# EAGLE design PoElli-mech-tests (EAGLE 6.5.0)

## Sheet 1 of 6
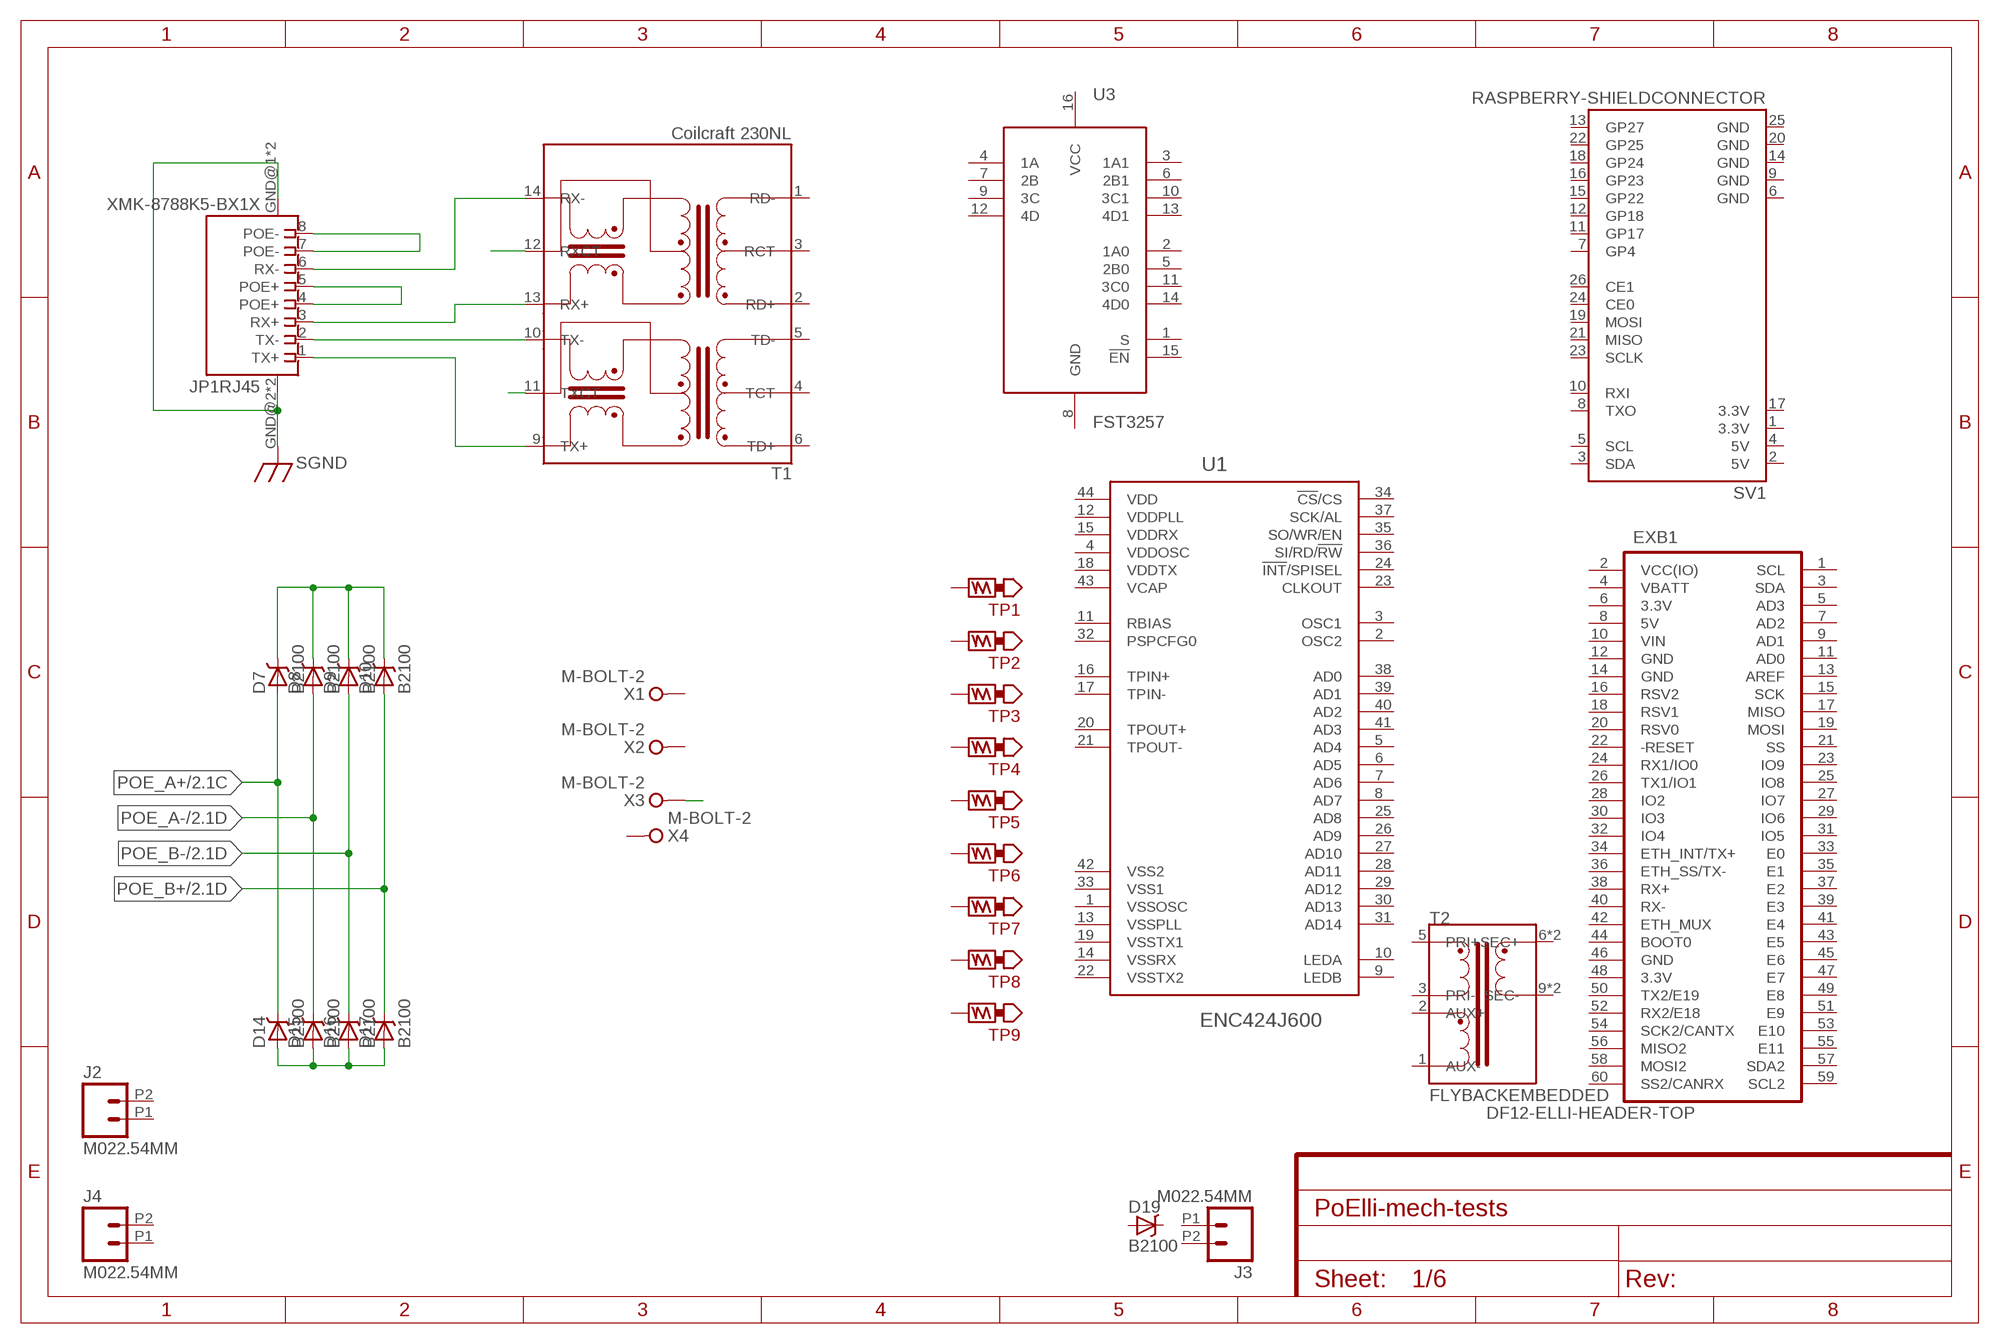
[diagram p0: schematic, sheet 1]

### Parts
D7  B2100  DIODE-SCHOTTKYB2100  [DIODE-B2100]
D8  B2100  DIODE-SCHOTTKYB2100  [DIODE-B2100]
D9  B2100  DIODE-SCHOTTKYB2100  [DIODE-B2100]
D10  B2100  DIODE-SCHOTTKYB2100  [DIODE-B2100]
D14  B2100  DIODE-SCHOTTKYB2100  [DIODE-B2100]
D15  B2100  DIODE-SCHOTTKYB2100  [DIODE-B2100]
D16  B2100  DIODE-SCHOTTKYB2100  [DIODE-B2100]
D17  B2100  DIODE-SCHOTTKYB2100  [DIODE-B2100]
D19  B2100  DIODE-SCHOTTKYB2100  [DIODE-B2100]
EXB1  DF12-ELLI-HEADER-TOP  [DF12(4.0)-60DP-0.5V]
J2  M022.54MM  M022.54MM_SCREWTERM  [1X02_2.54_SCREWTERM]
J3  M022.54MM  M022.54MM_SCREWTERM  [1X02_2.54_SCREWTERM]
J4  M022.54MM  M022.54MM_SCREWTERM  [1X02_2.54_SCREWTERM]
JP1  XMK-8788K5-BX1X  POE-TP-SHIELDED-LEDSTE1888250  [TE1888250]
SV1  RASPBERRY-SHIELDCONNECTOR  [RASPBERRYPI-SHIELD-CONNECTOR]
T1  Coilcraft 230NL  POE-ISOLATION-230NL  [COILCRAFT-ETH1-230L]
T2  FLYBACKEMBEDDED  [WE_EP13_SMD_10PIN_EMBEDDED]
TP1  TEST_POINT-5000  [TP_5021]
TP2  TEST_POINT-5021  [TP_5000]
TP3  TEST_POINT-5021  [TP_5000]
TP4  TEST_POINT-5021  [TP_5000]
TP5  TEST_POINT-5000  [TP_5021]
TP6  TEST_POINT-5000  [TP_5021]
TP7  TEST_POINT-5000  [TP_5021]
TP8  TEST_POINT-5000  [TP_5021]
TP9  TEST_POINT-5000  [TP_5021]
U1  ENC424J600  [TQFP44-0.8MM]
U3  FST3257  [SOIC-16-NARROW]
X1  M-BOLT-2  [M2-1]
X2  M-BOLT-2  [M2-1]
X3  M-BOLT-2  [M2-1]
X4  M-BOLT-2  [M2-1]

### Nets
N$1: JP1.2(RJ45:TX-) T1.10(TX-)
N$2: JP1.1(RJ45:TX+) T1.9(TX+)
N$3: JP1.3(RJ45:RX+) T1.13(RX+)
N$4: JP1.6(RJ45:RX-) T1.14(RX-)
N$6: D7.C D8.C D9.C D10.C
N$8: D14.A D15.A D16.A D17.A
N$10: JP1.7(RJ45:POE-) JP1.8(RJ45:POE-)
N$13: T1.11(TXCT)
N$21: X3.1(KL1)
POE_A+: D7.A D14.C ; also sheet 2
POE_A-: D8.A D15.C T1.12(RXCT) ; also sheet 2
POE_B+: D10.A D17.C JP1.4(RJ45:POE+) JP1.5(RJ45:POE+) ; also sheet 2
POE_B-: D9.A D16.C ; also sheet 2
RTN: JP1.GND@1(RJ45:GND) JP1.GND@2(RJ45:GND) JP1.GND@3(RJ45:GND) JP1.GND@4(RJ45:GND) ; supply symbol labelled SGND ; also sheet 2
Unconnected: D19.A D19.C EXB1.1(SCL) EXB1.3(SDA) EXB1.5(AD3) EXB1.7(AD2) EXB1.9(AD1) EXB1.11(AD0) EXB1.13(AREF) EXB1.15(SCK) EXB1.16(RSV2) EXB1.17(MISO) EXB1.18(RSV1) EXB1.19(MOSI) EXB1.20(RSV0) EXB1.21(SS) EXB1.22(-RESET) EXB1.23(IO9) EXB1.24(RX1/IO0) EXB1.25(IO8) EXB1.26(TX1/IO1) EXB1.27(IO7) EXB1.28(IO2) EXB1.29(IO6) EXB1.30(IO3) EXB1.31(IO5) EXB1.32(IO4) EXB1.33(E0) EXB1.34(ETH_INT/TX+) EXB1.35(E1) EXB1.36(ETH_SS/TX-) EXB1.37(E2) EXB1.38(RX+) EXB1.39(E3) EXB1.40(RX-) EXB1.41(E4) EXB1.42(ETH_MUX) EXB1.43(E5) EXB1.44(BOOT0) EXB1.45(E6) EXB1.46(GND) EXB1.47(E7) EXB1.48(3.3V) EXB1.49(E8) EXB1.50(TX2/E19) EXB1.51(E9) EXB1.52(RX2/E18) EXB1.53(E10) EXB1.54(SCK2/CANTX) EXB1.55(E11) EXB1.56(MISO2) EXB1.57(SDA2) EXB1.58(MOSI2) EXB1.59(SCL2) EXB1.60(SS2/CANRX) J2.P1 J2.P2 J3.P1 J3.P2 J4.P1 J4.P2 JP1.9(LED1:C) JP1.10(LED1:A) JP1.11(LED2:A) JP1.12(LED2:C) SV1.3(SDA) SV1.5(SCL) SV1.7(GP4) SV1.8(TXO) SV1.10(RXI) SV1.11(GP17) SV1.12(GP18) SV1.13(GP27) SV1.15(GP22) SV1.16(GP23) SV1.18(GP24) SV1.19(MOSI) SV1.21(MISO) SV1.22(GP25) SV1.23(SCLK) SV1.24(CE0) SV1.26(CE1) T1.1(RD-) T1.2(RD+) T1.3(RCT) T1.4(TCT) T1.5(TD-) T1.6(TD+) T2.1(AUX-) T2.2(AUX+) T2.3(PRI-) T2.5(PRI+) T2.6(SEC+) T2.7(SEC+) T2.9(SEC-) T2.10(SEC-) TP1.P$1 TP2.P$1 TP3.P$1 TP4.P$1 TP5.P$1 TP6.P$1 TP7.P$1 TP8.P$1 TP9.P$1 U1.2(OSC2) U1.3(OSC1) U1.5(AD4) U1.6(AD5) U1.7(AD6) U1.8(AD7) U1.9(LEDB) U1.10(LEDA) U1.11(RBIAS) U1.16(TPIN+) U1.17(TPIN-) U1.20(TPOUT+) U1.21(TPOUT-) U1.23(CLKOUT) U1.24(!INT!/SPISEL) U1.25(AD8) U1.26(AD9) U1.27(AD10) U1.28(AD11) U1.29(AD12) U1.30(AD13) U1.31(AD14) U1.32(PSPCFG0) U1.34(!CS!/CS) U1.35(SO/WR/EN) U1.36(SI/RD/!RW) U1.37(SCK/AL) U1.38(AD0) U1.39(AD1) U1.40(AD2) U1.41(AD3) U3.1(S) U3.2(1A0) U3.3(1A1) U3.4(1A) U3.5(2B0) U3.6(2B1) U3.7(2B) U3.9(3C) U3.10(3C1) U3.11(3C0) U3.12(4D) U3.13(4D1) U3.14(4D0) U3.15(!EN) X1.1(KL1) X2.1(KL1) X4.1(KL1)

## Sheet 2 of 6
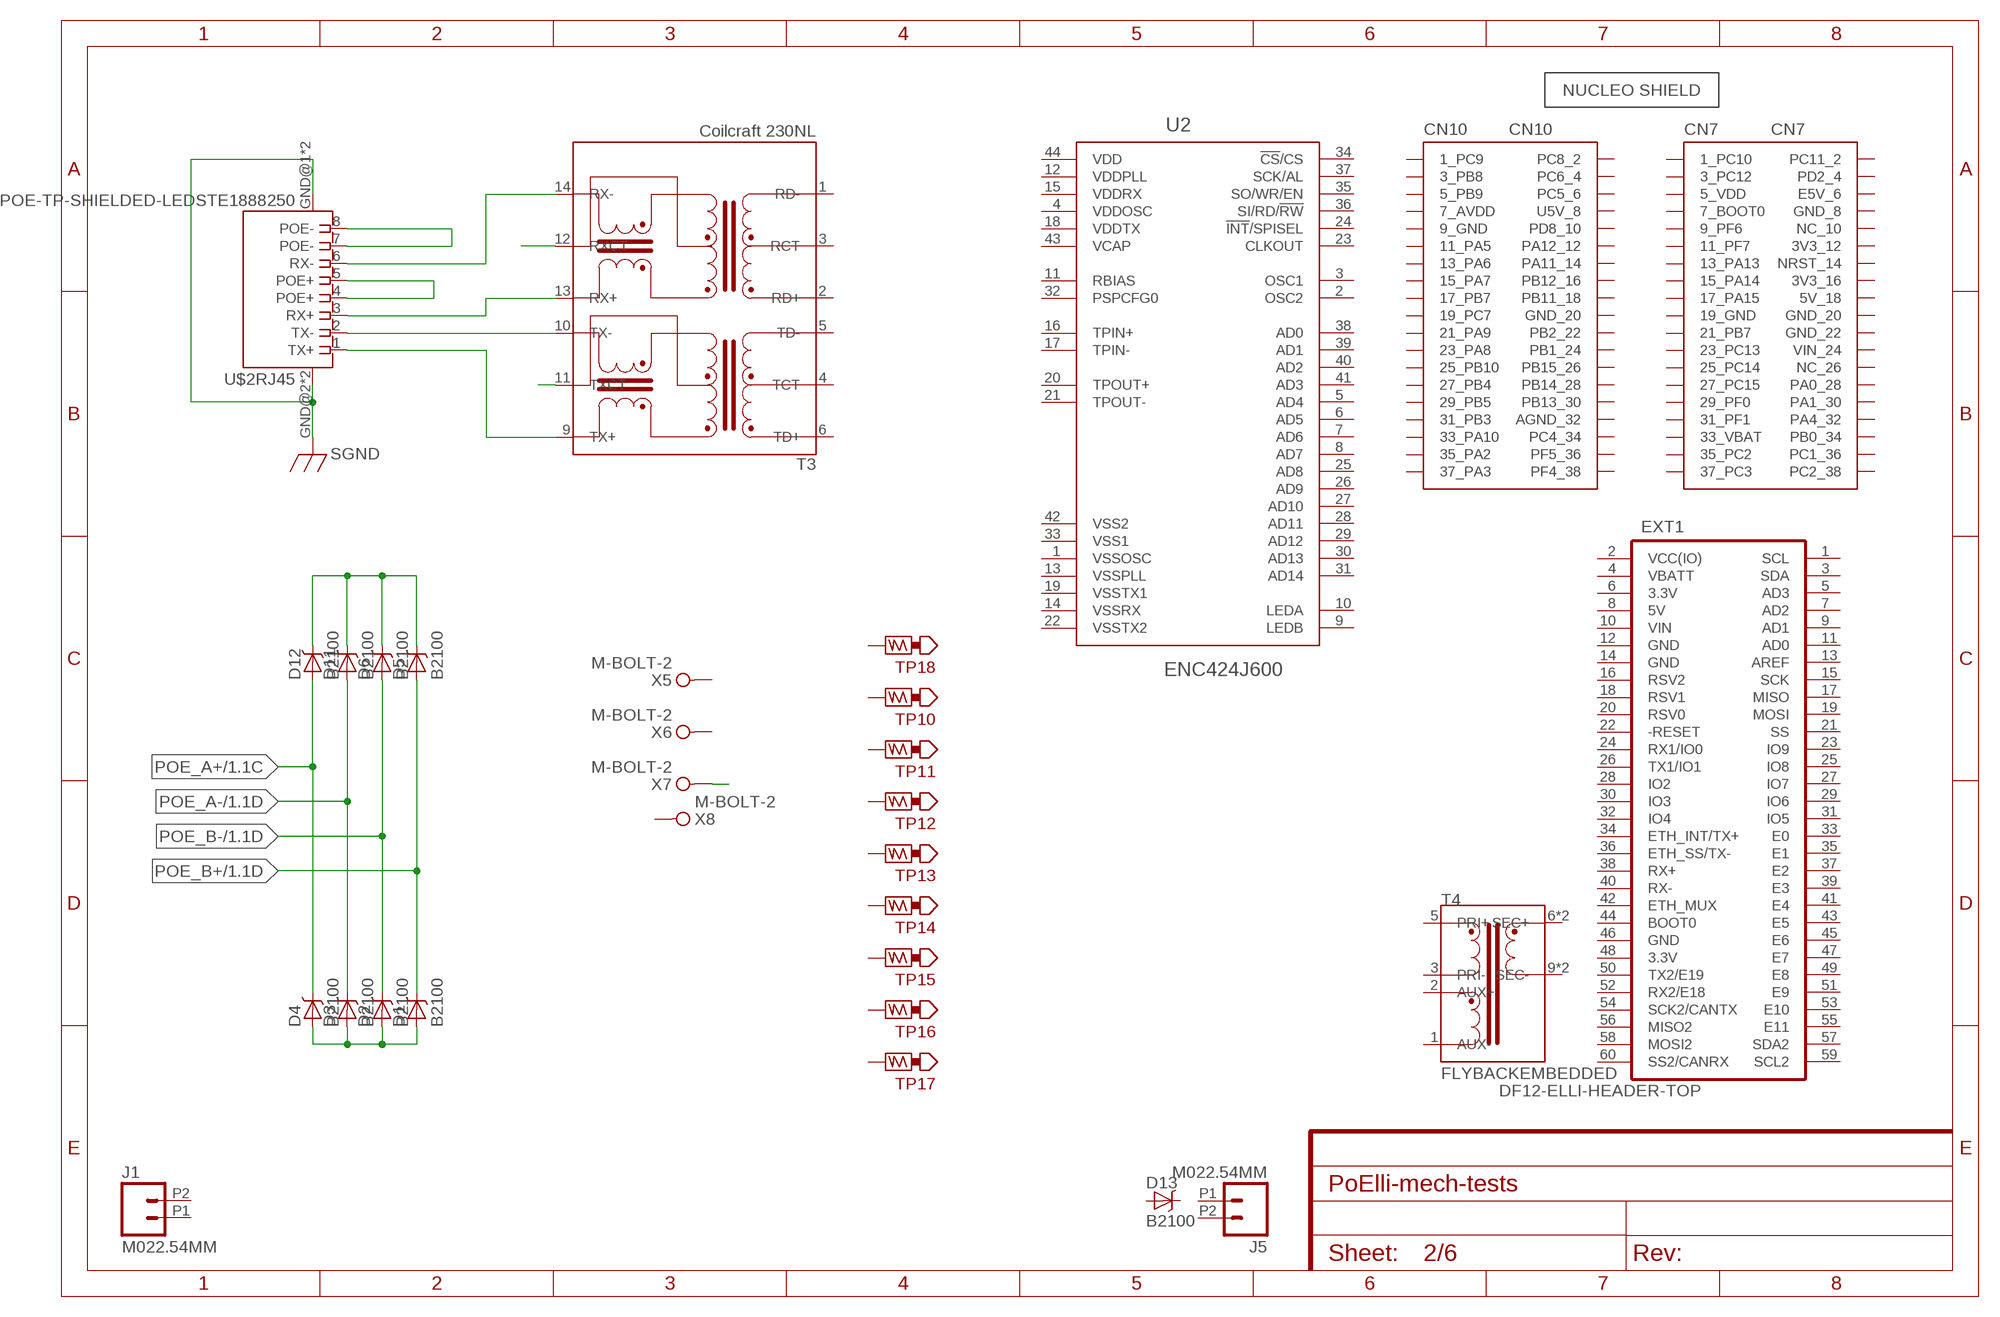
[diagram p1: schematic, sheet 2]

### Parts
CN7  NUCLEO-CN7  [NUCLEO-HEADER]
CN10  NUCLEO-CN10  [NUCLEO-HEADER]
D1  B2100  DIODE-SCHOTTKYB2100  [DIODE-B2100]
D2  B2100  DIODE-SCHOTTKYB2100  [DIODE-B2100]
D3  B2100  DIODE-SCHOTTKYB2100  [DIODE-B2100]
D4  B2100  DIODE-SCHOTTKYB2100  [DIODE-B2100]
D5  B2100  DIODE-SCHOTTKYB2100  [DIODE-B2100]
D6  B2100  DIODE-SCHOTTKYB2100  [DIODE-B2100]
D11  B2100  DIODE-SCHOTTKYB2100  [DIODE-B2100]
D12  B2100  DIODE-SCHOTTKYB2100  [DIODE-B2100]
D13  B2100  DIODE-SCHOTTKYB2100  [DIODE-B2100]
EXT1  DF12-ELLI-HEADER-TOP  [DF12(4.0)-60DP-0.5V]
J1  M022.54MM  M022.54MM_SCREWTERM  [1X02_2.54_SCREWTERM]
J5  M022.54MM  M022.54MM_SCREWTERM  [1X02_2.54_SCREWTERM]
NUCLEO  NUCLEO-OUTLINE-SHORT  [NUCLEO-SHIELD-UNDERSIDE-SHORT-OUTLINE]
T3  Coilcraft 230NL  POE-ISOLATION-230NL  [COILCRAFT-ETH1-230L]
T4  FLYBACKEMBEDDED  [WE_EP13_SMD_10PIN_EMBEDDED]
TP10  TEST_POINT-5021  [TP_5000]
TP11  TEST_POINT-5021  [TP_5000]
TP12  TEST_POINT-5021  [TP_5000]
TP13  TEST_POINT-5000  [TP_5021]
TP14  TEST_POINT-5000  [TP_5021]
TP15  TEST_POINT-5000  [TP_5021]
TP16  TEST_POINT-5000  [TP_5021]
TP17  TEST_POINT-5000  [TP_5021]
TP18  TEST_POINT-5000  [TP_5021]
U2  ENC424J600  [TQFP44-0.8MM]
U$2  POE-TP-SHIELDED-LEDSTE1888250  [TE1888250]
X5  M-BOLT-2  [M2-1]
X6  M-BOLT-2  [M2-1]
X7  M-BOLT-2  [M2-1]
X8  M-BOLT-2  [M2-1]

### Nets
N$5: T3.10(TX-) U$2.2(RJ45:TX-)
N$7: T3.9(TX+) U$2.1(RJ45:TX+)
N$9: T3.13(RX+) U$2.3(RJ45:RX+)
N$11: T3.14(RX-) U$2.6(RJ45:RX-)
N$12: D5.C D6.C D11.C D12.C
N$14: D1.A D2.A D3.A D4.A
N$15: X7.1(KL1)
N$16: U$2.7(RJ45:POE-) U$2.8(RJ45:POE-)
N$17: T3.11(TXCT)
POE_A+: D4.C D12.A ; also sheet 1
POE_A-: D3.C D11.A T3.12(RXCT) ; also sheet 1
POE_B+: D1.C D5.A U$2.4(RJ45:POE+) U$2.5(RJ45:POE+) ; also sheet 1
POE_B-: D2.C D6.A ; also sheet 1
RTN: U$2.GND@1(RJ45:GND) U$2.GND@2(RJ45:GND) U$2.GND@3(RJ45:GND) U$2.GND@4(RJ45:GND) ; supply symbol labelled SGND ; also sheet 1
Unconnected: CN7.1(1_PC10) CN7.2(PC11_2) CN7.3(3_PC12) CN7.4(PD2_4) CN7.5(5_VDD) CN7.6(E5V_6) CN7.7(7_BOOT0) CN7.8(GND_8) CN7.9(9_PF6) CN7.10(NC_10) CN7.11(11_PF7) CN7.12(3V3_12) CN7.13(13_PA13) CN7.14(NRST_14) CN7.15(15_PA14) CN7.16(3V3_16) CN7.17(17_PA15) CN7.18(5V_18) CN7.19(19_GND) CN7.20(GND_20) CN7.21(21_PB7) CN7.22(GND_22) CN7.23(23_PC13) CN7.24(VIN_24) CN7.25(25_PC14) CN7.26(NC_26) CN7.27(27_PC15) CN7.28(PA0_28) CN7.29(29_PF0) CN7.30(PA1_30) CN7.31(31_PF1) CN7.32(PA4_32) CN7.33(33_VBAT) CN7.34(PB0_34) CN7.35(35_PC2) CN7.36(PC1_36) CN7.37(37_PC3) CN7.38(PC2_38) CN10.1(1_PC9) CN10.2(PC8_2) CN10.3(3_PB8) CN10.4(PC6_4) CN10.5(5_PB9) CN10.6(PC5_6) CN10.7(7_AVDD) CN10.8(U5V_8) CN10.9(9_GND) CN10.10(PD8_10) CN10.11(11_PA5) CN10.12(PA12_12) CN10.13(13_PA6) CN10.14(PA11_14) CN10.15(15_PA7) CN10.16(PB12_16) CN10.17(17_PB7) CN10.18(PB11_18) CN10.19(19_PC7) CN10.20(GND_20) CN10.21(21_PA9) CN10.22(PB2_22) CN10.23(23_PA8) CN10.24(PB1_24) CN10.25(25_PB10) CN10.26(PB15_26) CN10.27(27_PB4) CN10.28(PB14_28) CN10.29(29_PB5) CN10.30(PB13_30) CN10.31(31_PB3) CN10.32(AGND_32) CN10.33(33_PA10) CN10.34(PC4_34) CN10.35(35_PA2) CN10.36(PF5_36) CN10.37(37_PA3) CN10.38(PF4_38) D13.A D13.C EXT1.1(SCL) EXT1.3(SDA) EXT1.5(AD3) EXT1.7(AD2) EXT1.9(AD1) EXT1.11(AD0) EXT1.13(AREF) EXT1.15(SCK) EXT1.16(RSV2) EXT1.17(MISO) EXT1.18(RSV1) EXT1.19(MOSI) EXT1.20(RSV0) EXT1.21(SS) EXT1.22(-RESET) EXT1.23(IO9) EXT1.24(RX1/IO0) EXT1.25(IO8) EXT1.26(TX1/IO1) EXT1.27(IO7) EXT1.28(IO2) EXT1.29(IO6) EXT1.30(IO3) EXT1.31(IO5) EXT1.32(IO4) EXT1.33(E0) EXT1.34(ETH_INT/TX+) EXT1.35(E1) EXT1.36(ETH_SS/TX-) EXT1.37(E2) EXT1.38(RX+) EXT1.39(E3) EXT1.40(RX-) EXT1.41(E4) EXT1.42(ETH_MUX) EXT1.43(E5) EXT1.44(BOOT0) EXT1.45(E6) EXT1.46(GND) EXT1.47(E7) EXT1.48(3.3V) EXT1.49(E8) EXT1.50(TX2/E19) EXT1.51(E9) EXT1.52(RX2/E18) EXT1.53(E10) EXT1.54(SCK2/CANTX) EXT1.55(E11) EXT1.56(MISO2) EXT1.57(SDA2) EXT1.58(MOSI2) EXT1.59(SCL2) EXT1.60(SS2/CANRX) J1.P1 J1.P2 J5.P1 J5.P2 T3.1(RD-) T3.2(RD+) T3.3(RCT) T3.4(TCT) T3.5(TD-) T3.6(TD+) T4.1(AUX-) T4.2(AUX+) T4.3(PRI-) T4.5(PRI+) T4.6(SEC+) T4.7(SEC+) T4.9(SEC-) T4.10(SEC-) TP10.P$1 TP11.P$1 TP12.P$1 TP13.P$1 TP14.P$1 TP15.P$1 TP16.P$1 TP17.P$1 TP18.P$1 U2.2(OSC2) U2.3(OSC1) U2.5(AD4) U2.6(AD5) U2.7(AD6) U2.8(AD7) U2.9(LEDB) U2.10(LEDA) U2.11(RBIAS) U2.16(TPIN+) U2.17(TPIN-) U2.20(TPOUT+) U2.21(TPOUT-) U2.23(CLKOUT) U2.24(!INT!/SPISEL) U2.25(AD8) U2.26(AD9) U2.27(AD10) U2.28(AD11) U2.29(AD12) U2.30(AD13) U2.31(AD14) U2.32(PSPCFG0) U2.34(!CS!/CS) U2.35(SO/WR/EN) U2.36(SI/RD/!RW) U2.37(SCK/AL) U2.38(AD0) U2.39(AD1) U2.40(AD2) U2.41(AD3) U$2.9(LED1:C) U$2.10(LED1:A) U$2.11(LED2:A) U$2.12(LED2:C) X5.1(KL1) X6.1(KL1) X8.1(KL1)

## Sheet 3 of 6
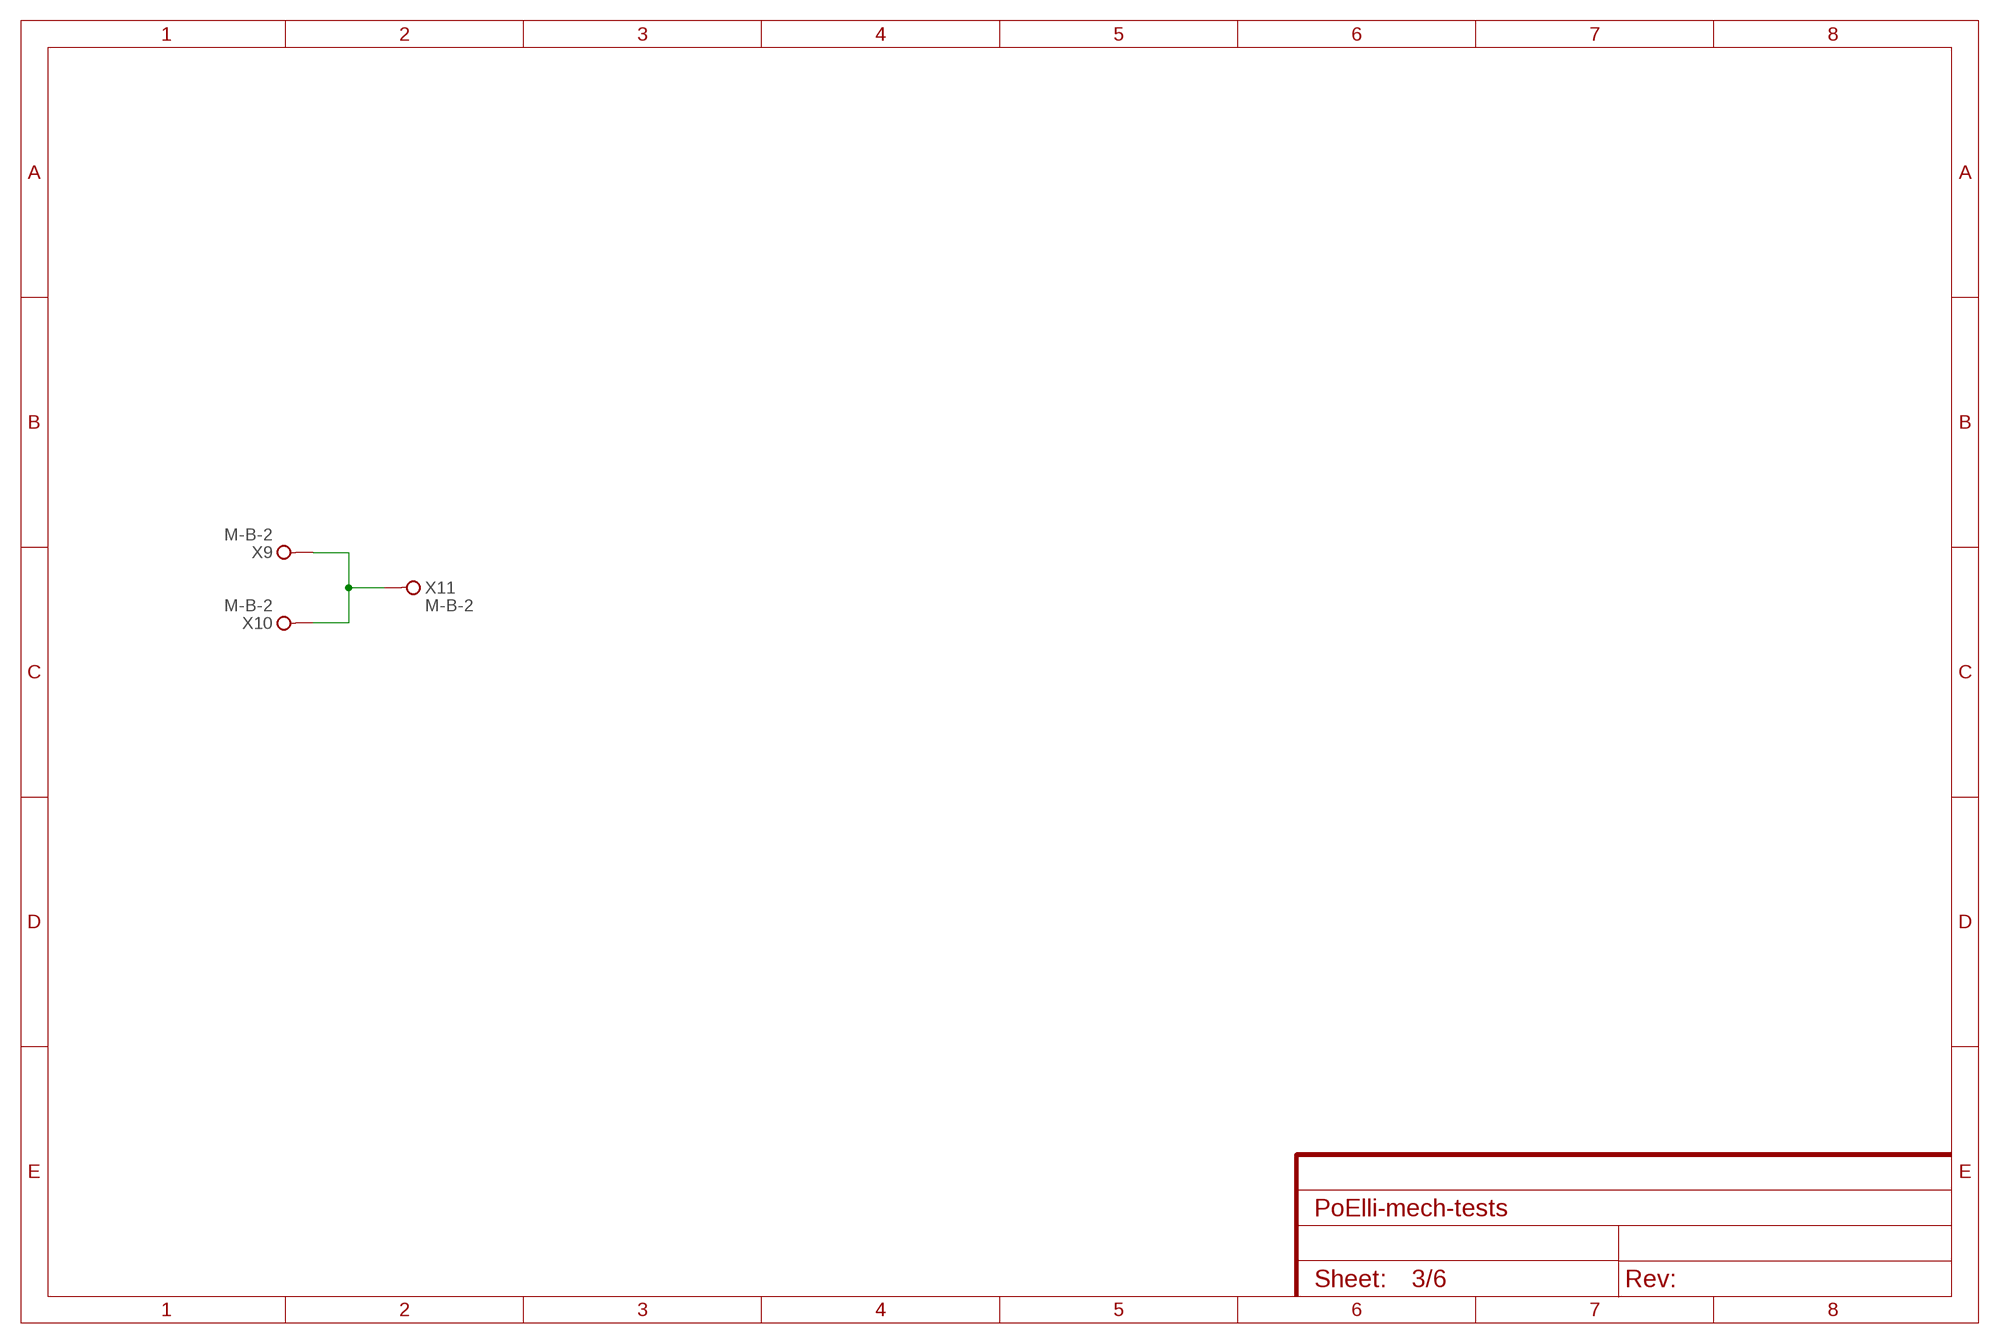
[diagram p2: schematic, sheet 3]

### Parts
X9  M-B-2  M-BOLT-2  [M2-1]
X10  M-B-2  M-BOLT-2  [M2-1]
X11  M-B-2  M-BOLT-2  [M2-1]

### Nets
PTEST [power]: X9.1(KL1) X10.1(KL1) X11.1(KL1)

## Sheet 4 of 6
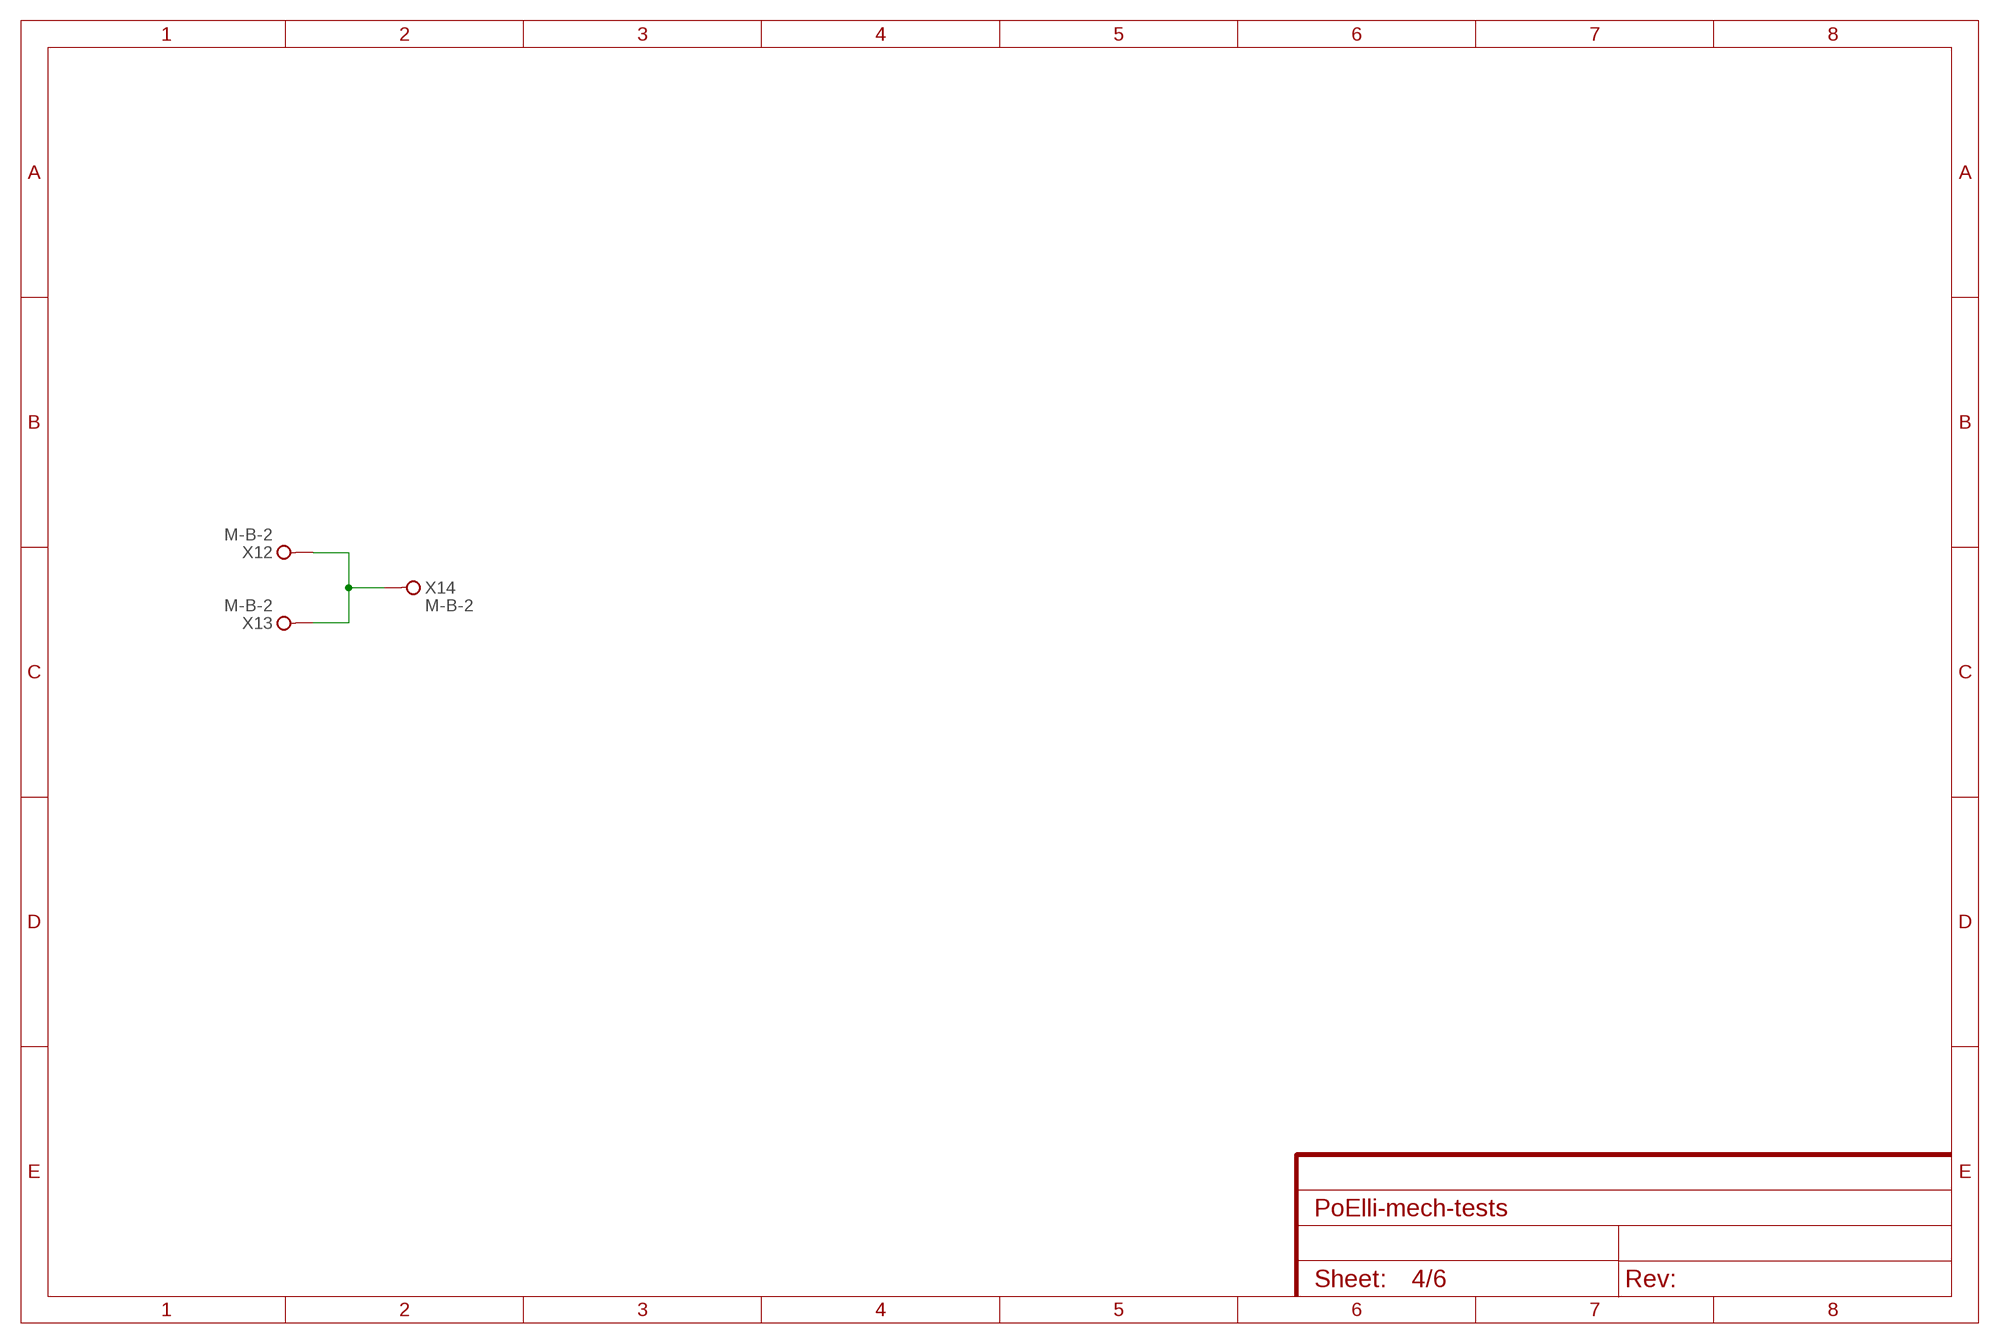
[diagram p3: schematic, sheet 4]

### Parts
X12  M-B-2  M-BOLT-2  [M2-1]
X13  M-B-2  M-BOLT-2  [M2-1]
X14  M-B-2  M-BOLT-2  [M2-1]

### Nets
PTEST1 [power]: X12.1(KL1) X13.1(KL1) X14.1(KL1)

## Sheet 5 of 6
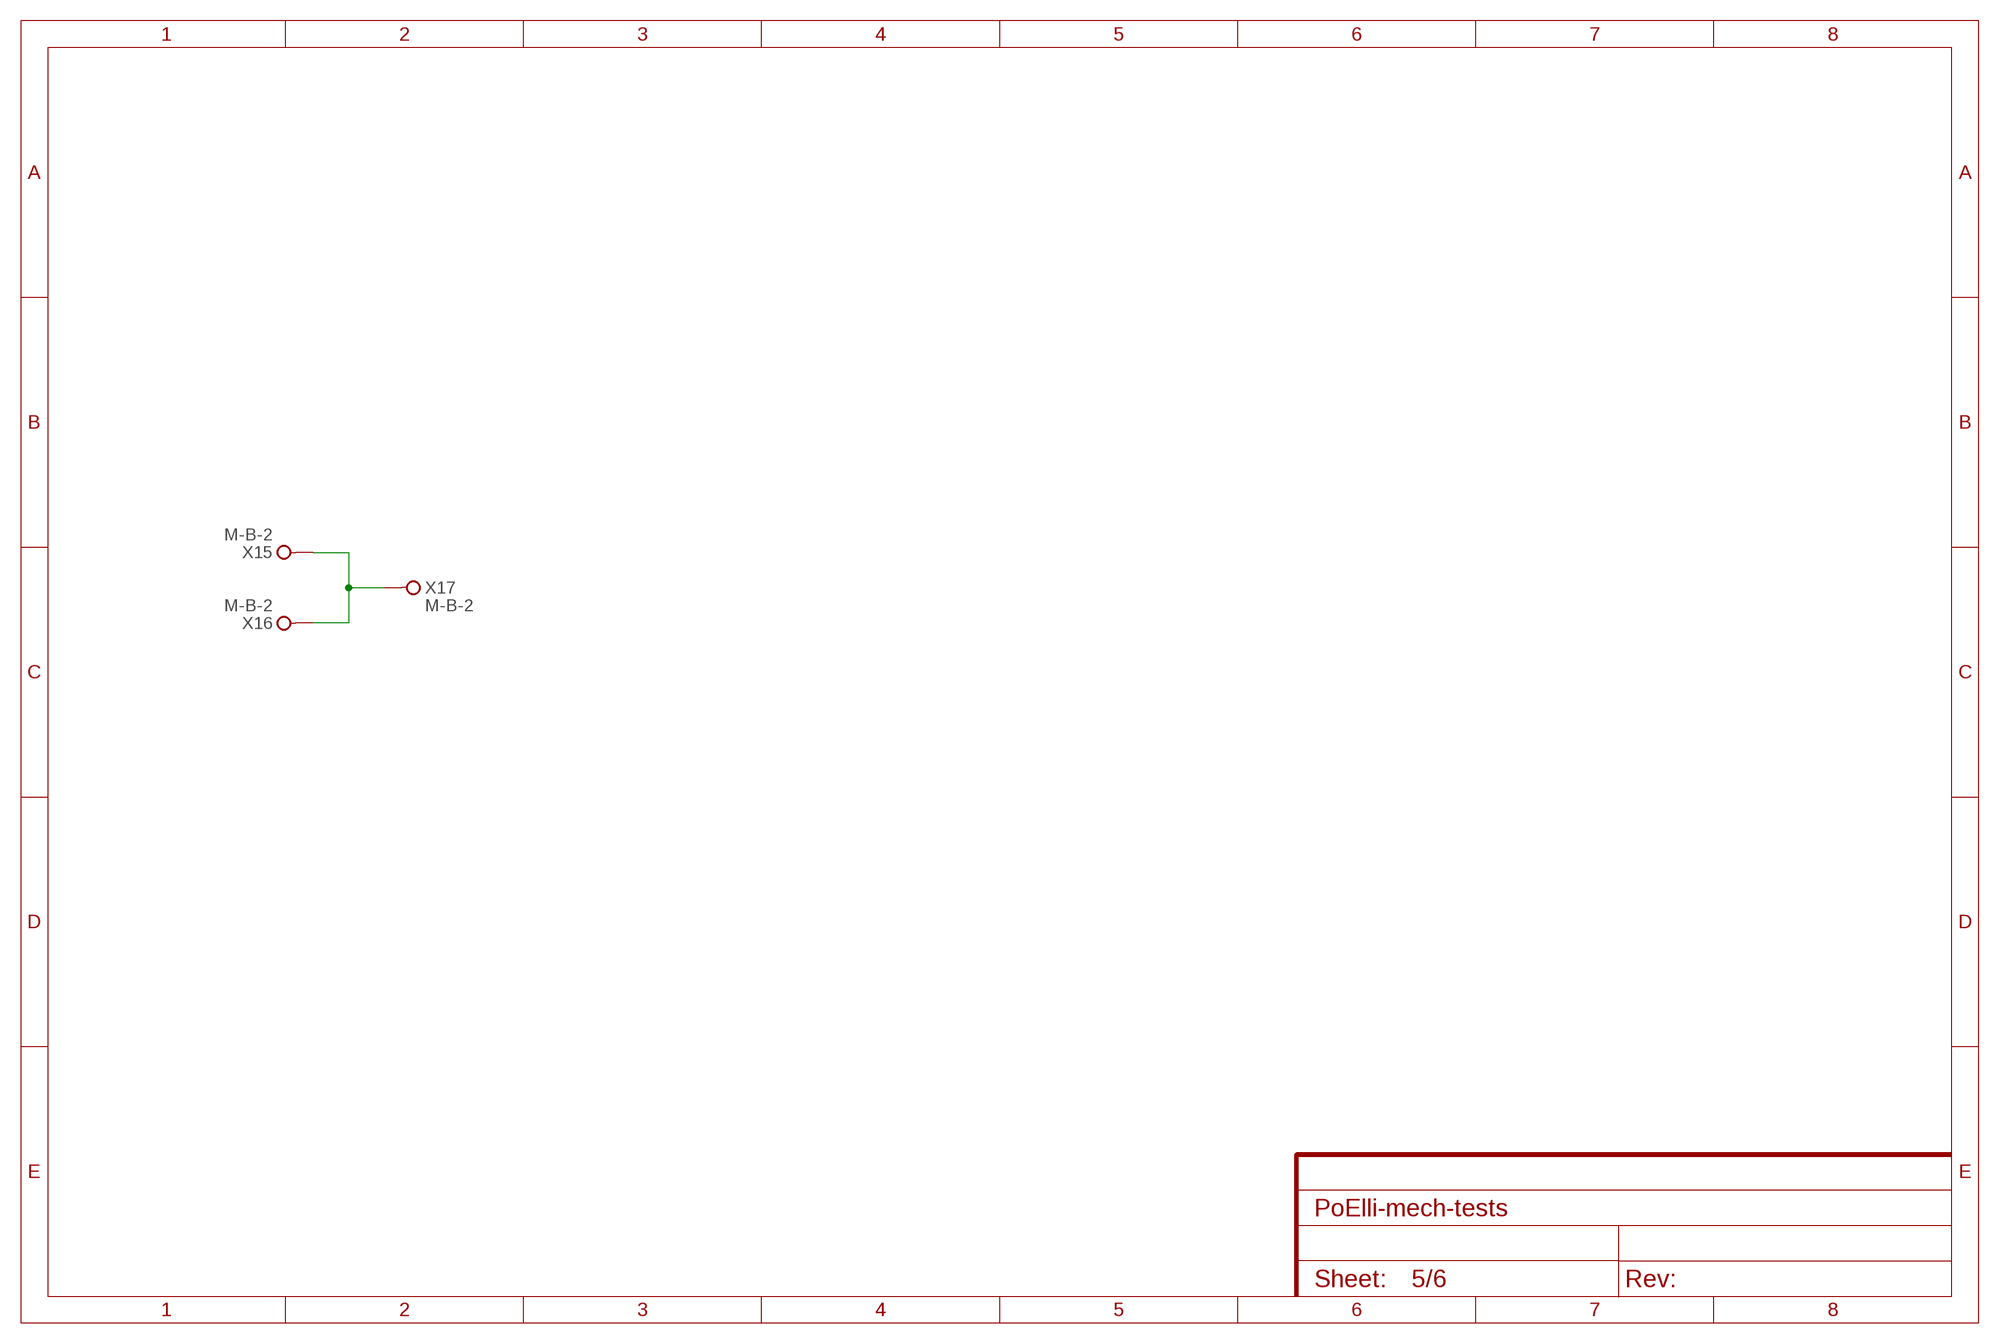
[diagram p4: schematic, sheet 5]

### Parts
X15  M-B-2  M-BOLT-2  [M2-1]
X16  M-B-2  M-BOLT-2  [M2-1]
X17  M-B-2  M-BOLT-2  [M2-1]

### Nets
PTEST2 [power]: X15.1(KL1) X16.1(KL1) X17.1(KL1)

## Sheet 6 of 6
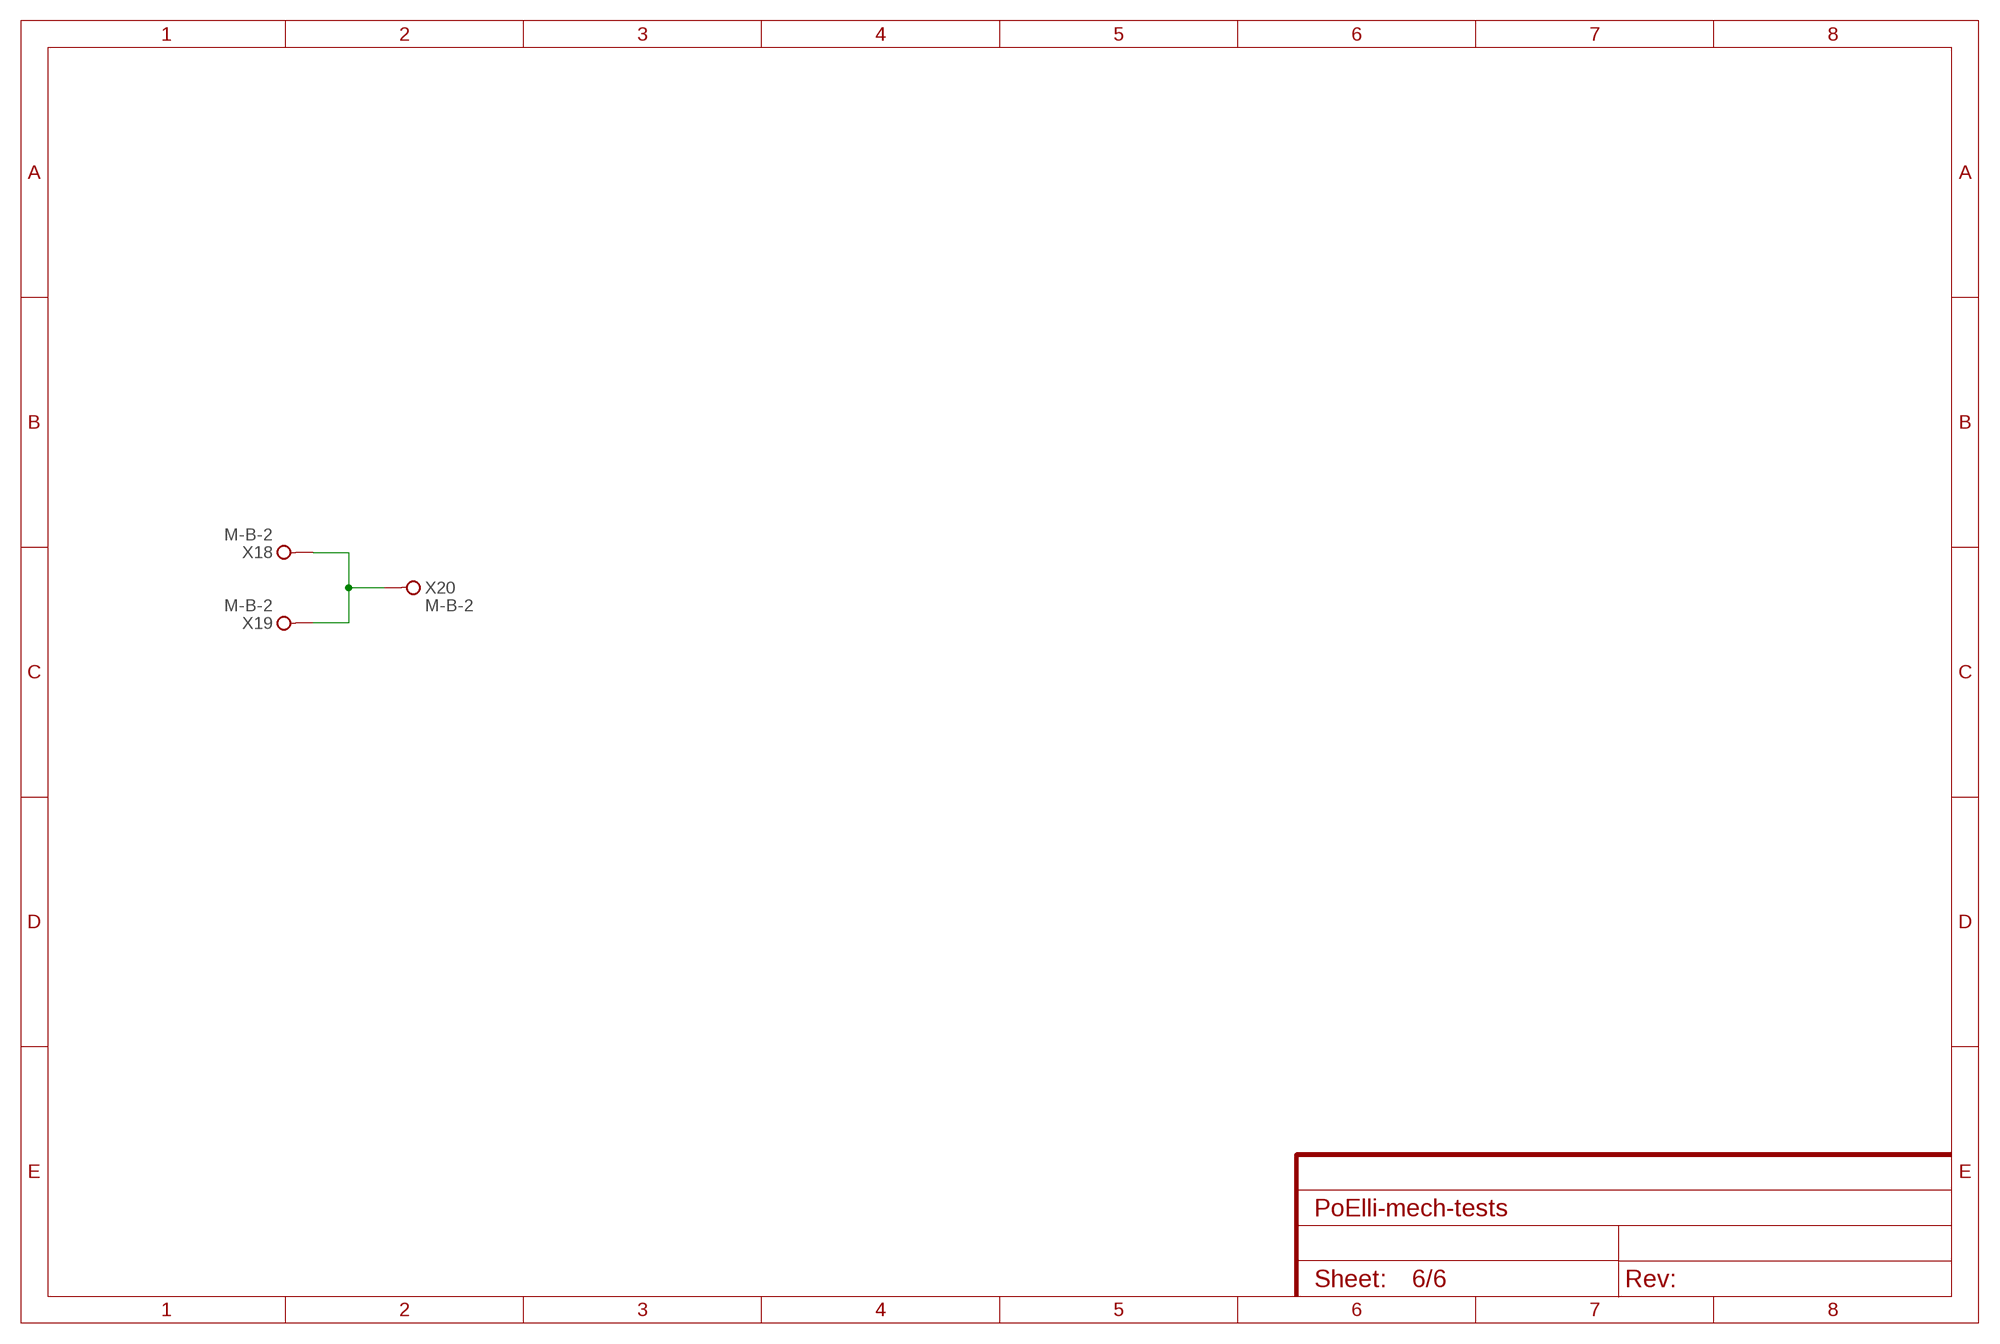
[diagram p5: schematic, sheet 6]

### Parts
X18  M-B-2  M-BOLT-2  [M2-1]
X19  M-B-2  M-BOLT-2  [M2-1]
X20  M-B-2  M-BOLT-2  [M2-1]

### Nets
PTEST3 [power]: X18.1(KL1) X19.1(KL1) X20.1(KL1)

## Power pins joined to a net without a drawn wire
3.3V: EXB1.6(3.3V) SV1.1(3.3V) SV1.17(3.3V)
3.3V1: EXT1.6(3.3V)
5V: EXB1.8(5V) SV1.2(5V) SV1.4(5V)
5V1: EXT1.8(5V)
GND: EXB1.12(GND) EXB1.14(GND) SV1.6(GND) SV1.9(GND) SV1.14(GND) SV1.20(GND) SV1.25(GND) U3.8(GND)
GND1: EXT1.12(GND) EXT1.14(GND)
VBATT: EXB1.4(VBATT)
VBATT1: EXT1.4(VBATT)
VCAP: U1.43(VCAP)
VCAP1: U2.43(VCAP)
VCC: U3.16(VCC)
VCC(IO): EXB1.2(VCC(IO))
VCC(IO)1: EXT1.2(VCC(IO))
VDD: U1.44(VDD)
VDD1: U2.44(VDD)
VDDOSC: U1.4(VDDOSC)
VDDOSC1: U2.4(VDDOSC)
VDDPLL: U1.12(VDDPLL)
VDDPLL1: U2.12(VDDPLL)
VDDRX: U1.15(VDDRX)
VDDRX1: U2.15(VDDRX)
VDDTX: U1.18(VDDTX)
VDDTX1: U2.18(VDDTX)
VIN: EXB1.10(VIN)
VIN1: EXT1.10(VIN)
VSS1: U1.33(VSS1)
VSS2: U1.42(VSS2)
VSS3: U2.42(VSS2)
VSS4: U2.33(VSS1)
VSSOSC: U1.1(VSSOSC)
VSSOSC1: U2.1(VSSOSC)
VSSPLL: U1.13(VSSPLL)
VSSPLL1: U2.13(VSSPLL)
VSSRX: U1.14(VSSRX)
VSSRX1: U2.14(VSSRX)
VSSTX1: U1.19(VSSTX1)
VSSTX2: U1.22(VSSTX2)
VSSTX3: U2.19(VSSTX1)
VSSTX4: U2.22(VSSTX2)

## Library data of the parts
CN7 = ELL-i-Boards:NUCLEO-CN7
CN10 = ELL-i-Boards:NUCLEO-CN10
D1-D17 D19 = ELL-i-DIscreteSemi:DIODE-SCHOTTKY: Schottky Diodes A Schottky diode has a low forward voltage drop and a very fast switching action. A normal silicon diode has a voltage drop between 0.6–0.7 volts, while a Schottky diode voltage drop is between approximately 0.15–0.45 volts. This lower voltage drop can provide higher switching speed and better system efficiency. Wikipedia article on Schottky diodes <https://en.wikipedia.org/wiki/Schottky_diode>
EXB1 EXT1 = ELL-i-Connectors:DF12-ELLI-*
J1-J5 = SparkFun-Connectors:M02: Standard 2-pin 0.1" header. Use with - straight break away headers ( PRT-00116) - right angle break away headers (PRT-00553) - swiss pins (PRT-00743) - machine pins (PRT-00117) - female headers (PRT-00115) Molex polarized connector foot print use with: PRT-08233 with associated crimp pins and housings. 2.54_SCREWTERM for use with PRT-10571. 3.5mm Screw Terminal footprints for PRT-08084 5mm Screw Terminal footprints for use with PRT-08433
JP1 U$2 = ELL-i-Connectors:POE-TP-SHIELDED-LEDS
NUCLEO = ELL-i-Boards:NUCLEO-OUTLINE
SV1 = ELL-i-Boards:RASPBERRY-SHIELD
T1 T3 = ELL-i-Transformers:POE-ISOLATION: Power-over-Ethernet isolation transformers In twisted pair Ethernet networks, there is a 1500V isolation transformer between the network cable and the connected device. In Power-over-Ethernet devices, the transformer provides the extra function of allowing the DC power to be extracted from the cable-side center taps of the transformer. For high-power PoE, the transformer cable-side winding must be of thick enough wire (i.e. have low-enough resistance) to carry the DC current without warming up too much. Isolation transformers <https://en.wikipedia.org/wiki/Isolation_transformer> (general article) Power-over-Ethernet <https://en.wikipedia.org/wiki/Power_over_Ethernet> (general article)
T2 T4 = ELL-i-Transformers:FLYBACK: Flyback SMPS transformer These types of transformers are often used in flyback and forward SMPS converters. The primary-side auxillary winding typically used to generate a 7-12 V auxillary voltage, which is used to generate the operating voltage (VCC) for the SMPS controller chip. The packages includes the ones used at various ELL-i boards.
TP1-TP18 = ELL-i-Passives:TEST_POINT: Used for easier attachment of measuring equipment. Has both test loops and bare copper area.
U1 U2 = ELL-i-DigitalIC:ENC424J600: ENC424J600 The ENC424J600 and ENC624J600 are stand-alone, Fast Ethernet controllers with an industry standard Serial Peripheral Interface (SPI) or a flexible parallel interface. They are designed to serve as an Ethernet network interface for any microcontroller equipped with SPI or a standard parallel port Not reviewed. Datasheet <http://ww1.microchip.com/downloads/en/DeviceDoc/39935b.pdf>
U3 = ELL-i-DigitalIC:FST3257: Quad 2:1 Multiplexer / Demultiplexer Bus Switch
X1-X20 = ELL-i-Connectors:M-BOLT: Metric bolt connector

## Net classes
1 power: width 0.813 mm, drill 0.813 mm, clearance 0.152 mm

## Board
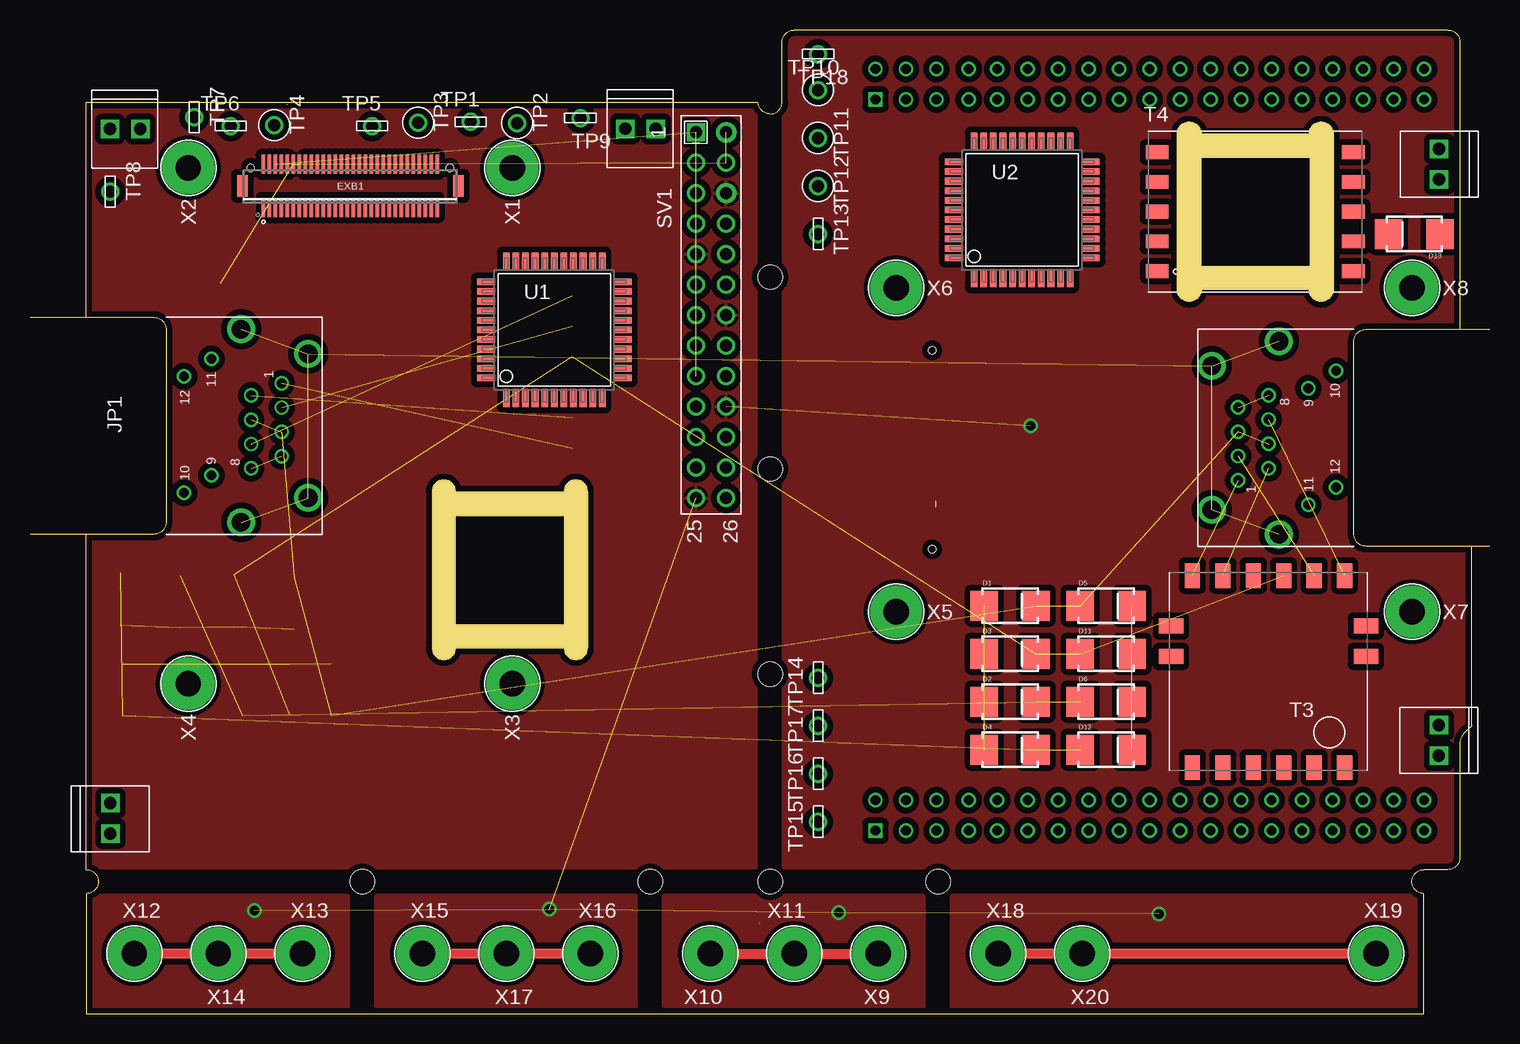
[diagram p6: board, top side]
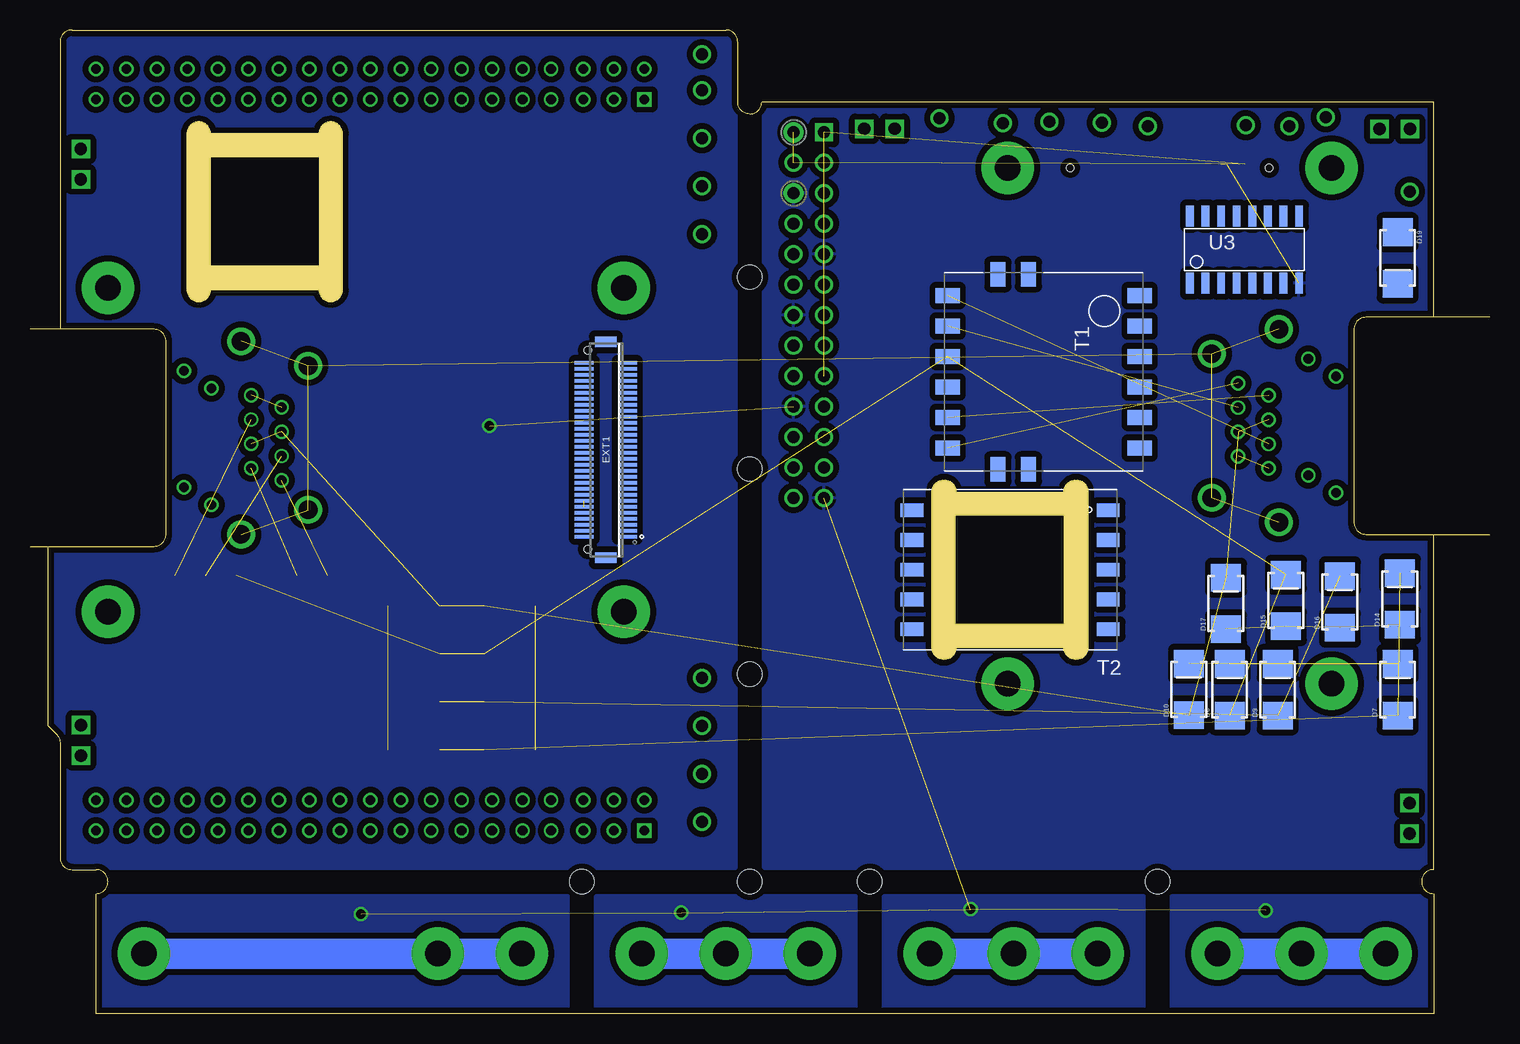
[diagram p7: board, bottom side, seen from below]

Size 121.7 x 82 mm. Coordinates in mm from the lower left corner, seen from the top.
Outline: 4.7,39.95 4.7,12 arc-90 5.7,11 arc-90 4.7,10 4.7,0 116.2,0 116.2,10 arc-90 115.2,11 arc-90 116.2,12 118.2,12 arc90 119.2,13 119.2,22.59 arc-45 119.49,23.29 120.2,24 120.2,38.95
Outline: 4.7,58.05 4.7,76 60.7,76 arc90 61.7,75 arc90 62.7,76 62.7,81 arc-90 63.7,82 118.2,82 arc-90 119.2,81 119.2,57.05
Outline: 52.7,0 74.7,0
Outline: 28.7,0 50.7,0
Copper layers (1*16): Top 0.035mm / dielectric 1.5mm / Bottom 0.035mm
Design rules "default *": minimum track width 0.15mm, minimum drill 0.4mm, track to track 0.5mm, track to pad 0.5mm, pad to pad 0.5mm, via to via 0.5mm, smd to smd 0mil, copper to edge 0.5mm, drill to drill 8mil, minimum pad ring 0.2mm, minimum via ring 0.2mm, stop-mask expansion 4mil, vias tented up to drill 0mil, thermal gap 10mil
Holes 2 mm at 27.7,11 51.7,11 61.7,11 75.7,11 61.7,28.3 61.7,45.4 61.7,61.4
tRestrict: 8 lines
bRestrict: 8 lines

### Footprints (pad centres in the part's own frame; a part is rotated, then mirrored left to right if it is on the bottom)
NUCLEO-HEADER = drill 0.8 square: 1 0,0 | drill 0.8: 2 0,2.54; 3 2.54,0; 4 2.54,2.54; 5 5.08,0; 6 5.08,2.54; 7 7.78,0; 8 7.78,2.54; 9 10.16,0; 10 10.16,2.54; 11 12.7,0; 12 12.7,2.54; 13 15.24,0; 14 15.24,2.54; 15 17.78,0; 16 17.78,2.54; 17 20.32,0; 18 20.32,2.54; 19 22.86,0; 20 22.86,2.54; 21 25.4,0; 22 25.4,2.54; 23 27.94,0; 24 27.94,2.54; 25 30.48,0; 26 30.48,2.54; 27 33.02,0; 28 33.02,2.54; 29 35.56,0; 30 35.56,2.54; 31 38.1,0; 32 38.1,2.54; 33 40.64,0; 34 40.64,2.54; 35 43.18,0; 36 43.18,2.54; 37 45.72,0; 38 45.72,2.54
DIODE-B2100 = smd 2.3 x 2.5: A -2.15,0; C 2.15,0
DF12(4.0)-60DP-0.5V = smd 0.3 x 1.6: 1 -7.25,-1.8; 2 -7.25,1.8; 3 -6.75,-1.8; 4 -6.75,1.8; 5 -6.25,-1.8; 6 -6.25,1.8; 7 -5.75,-1.8; 8 -5.75,1.8; 9 -5.25,-1.8; 10 -5.25,1.8; 11 -4.75,-1.8; 12 -4.75,1.8; 13 -4.25,-1.8; 14 -4.25,1.8; 15 -3.75,-1.8; 16 -3.75,1.8; 17 -3.25,-1.8; 18 -3.25,1.8; 19 -2.75,-1.8; 20 -2.75,1.8; 21 -2.25,-1.8; 22 -2.25,1.8; 23 -1.75,-1.8; 24 -1.75,1.8; 25 -1.25,-1.8; 26 -1.25,1.8; 27 -0.75,-1.8; 28 -0.75,1.8; 29 -0.25,-1.8; 30 -0.25,1.8; 31 0.25,-1.8; 32 0.25,1.8; 33 0.75,-1.8; 34 0.75,1.8; 35 1.25,-1.8; 36 1.25,1.8; 37 1.75,-1.8; 38 1.75,1.8; 39 2.25,-1.8; 40 2.25,1.8; 41 2.75,-1.8; 42 2.75,1.8; 43 3.25,-1.8; 44 3.25,1.8; 45 3.75,-1.8; 46 3.75,1.8; 47 4.25,-1.8; 48 4.25,1.8; 49 4.75,-1.8; 50 4.75,1.8; 51 5.25,-1.8; 52 5.25,1.8; 53 5.75,-1.8; 54 5.75,1.8; 55 6.25,-1.8; 56 6.25,1.8; 57 6.75,-1.8; 58 6.75,1.8; 59 7.25,-1.8; 60 7.25,1.8 | smd 0.9 x 1.8: F1 -9,0; F2 9,0 | hole 0.6: -8.3,1.5; 8.3,1.5
1X02_2.54_SCREWTERM = drill 1.016 square: P1 2.54,0; P2 0,0
TE1888250 = drill 0.8: 1 -3.556,20.98; 2 -2.54,18.44; 3 -1.524,20.98; 4 -0.508,18.44; 5 0.508,20.98; 6 1.524,18.44; 7 2.54,20.98; 8 3.556,18.44; 9 4.14,15.14; 10 5.58,12.84; 11 -5.58,15.14; 12 -4.14,12.84 | drill 1.55: GND@1 -8.054,17.59; GND@2 8.045,17.59; GND@3 -6,23.19; GND@4 6,23.19
RASPBERRYPI-SHIELD-CONNECTOR = drill 1 square: 1 2.54,50.8 | drill 1 pad 1.676: 2 2.54,53.34; 6 7.62,53.34 | drill 1: 3 5.08,50.8; 4 5.08,53.34; 5 7.62,50.8; 7 10.16,50.8; 8 10.16,53.34; 9 12.7,50.8; 10 12.7,53.34; 11 15.24,50.8; 12 15.24,53.34; 13 17.78,50.8; 14 17.78,53.34; 15 20.32,50.8; 16 20.32,53.34; 17 22.86,50.8; 18 22.86,53.34; 19 25.4,50.8; 20 25.4,53.34; 21 27.94,50.8; 22 27.94,53.34; 23 30.48,50.8; 24 30.48,53.34; 25 33.02,50.8; 26 33.02,53.34
COILCRAFT-ETH1-230L = smd 1.27 x 2.032: 1 -6.35,8.001; 2 -3.81,8.001; 3 -1.27,8.001; 4 1.27,8.001; 5 3.81,8.001; 6 6.35,8.001; 9 6.35,-8.001; 10 3.81,-8.001; 11 1.27,-8.001; 12 -1.27,-8.001; 13 -3.81,-8.001; 14 -6.35,-8.001 | smd 2.032 x 1.27: 7 8.128,-1.27; 8 8.128,-3.81; 15 -8.128,-3.81; 16 -8.128,-1.27
WE_EP13_SMD_10PIN_EMBEDDED = smd 1.88 x 1.143: 1 -8.18,-4.96; 2 -8.18,-2.48; 3 -8.18,0; 4 -8.18,2.48; 5 -8.18,4.96; 6 8.18,4.96; 7 8.18,2.48; 8 8.18,0; 9 8.18,-2.48; 10 8.18,-4.96
TP_5021 = drill 1: P$1 0,0
TP_5000 = drill 1: P$1 0,0
TQFP44-0.8MM = smd 0.55 x 1.5: 1 -4,-5.7; 2 -3.2,-5.7; 3 -2.4,-5.7; 4 -1.6,-5.7; 5 -0.8,-5.7; 6 0,-5.7; 7 0.8,-5.7; 8 1.6,-5.7; 9 2.4,-5.7; 10 3.2,-5.7; 11 4,-5.7; 23 4,5.7; 24 3.2,5.7; 25 2.4,5.7; 26 1.6,5.7; 27 0.8,5.7; 28 0,5.7; 29 -0.8,5.7; 30 -1.6,5.7; 31 -2.4,5.7; 32 -3.2,5.7; 33 -4,5.7 | smd 1.5 x 0.55: 12 5.7,-4; 13 5.7,-3.2; 14 5.7,-2.4; 15 5.7,-1.6; 16 5.7,-0.8; 17 5.7,0; 18 5.7,0.8; 19 5.7,1.6; 20 5.7,2.4; 21 5.7,3.2; 22 5.7,4; 34 -5.7,4; 35 -5.7,3.2; 36 -5.7,2.4; 37 -5.7,1.6; 38 -5.7,0.8; 39 -5.7,0; 40 -5.7,-0.8; 41 -5.7,-1.6; 42 -5.7,-2.4; 43 -5.7,-3.2; 44 -5.7,-4
SOIC-16-NARROW = smd 0.65 x 1.75: 1 -4.55,-2.8; 2 -3.25,-2.8; 3 -1.95,-2.8; 4 -0.65,-2.8; 5 0.65,-2.8; 6 1.95,-2.8; 7 3.25,-2.8; 8 4.55,-2.8; 9 4.55,2.8; 10 3.25,2.8; 11 1.95,2.8; 12 0.65,2.8; 13 -0.65,2.8; 14 -1.95,2.8; 15 -3.25,2.8; 16 -4.55,2.8
M2-1 = drill 2.1 pad 4.4: 1 0,0

### Placement (x,y rotation side)
CN7  70.48,15.25 0 top
CN10  70.48,76.21 0 top
D1  81.7,34 0 top
D2  81.7,26 0 top
D3  81.7,30 0 top
D4  81.7,22 0 top
D5  89.7,34 0 top
D6  89.7,26 0 top
D7  7.7,27 90 bottom
D8  21.7,27 90 bottom
D9  17.7,27 90 bottom
D10  25.09,27.02 90 bottom
D11  89.7,30 0 top
D12  89.7,22 0 top
D13  115.4,65 180 top
D14  7.51,34.56 90 bottom
D15  17.01,34.44 90 bottom
D16  12.51,34.32 90 bottom
D17  22.01,34.2 90 bottom
D19  7.7,63 270 bottom
EXB1  26.7,69 0 top
EXT1  73.7,47 90 bottom
J1  117.45,24.04 270 top
J2  6.7,15 90 top
J3  49.62,73.76 0 top
J4  6.66,73.75 0 top
J5  117.46,72.08 270 top
JP1  0,49 270 top
NUCLEO  62.7,12 0 top
SV1  4.7,76 270 top
T1  37.2,53.5 270 bottom
T2  40,37 180 bottom
T3  103.24,28.51 180 top
T4  102.13,66.85 0 top
TP1  36.74,74.34 0 top
TP2  40.61,74.25 270 top
TP3  32.34,74.28 270 top
TP4  20.34,74.06 270 top
TP5  28.52,73.99 0 top
TP6  16.74,73.99 0 top
TP7  13.69,74.74 270 top
TP8  6.69,68.52 270 top
TP9  45.88,74.66 180 top
TP10  65.7,77 0 top
TP11  65.7,73 270 top
TP12  65.7,69 270 top
TP13  65.7,65 270 top
TP14  65.7,28 90 top
TP15  65.7,16 90 top
TP16  65.7,20 90 top
TP17  65.7,24 90 top
TP18  65.7,80 180 top
U1  43.7,57 0 top
U2  82.7,67 0 top
U3  20.46,63.68 0 bottom
U$2  121.7,48 90 top
X1  40.2,70.5 270 top
X2  13.2,70.5 270 top
X3  40.2,27.5 270 top
X4  13.2,27.5 270 top
X5  72.2,33.5 0 top
X6  72.2,60.5 0 top
X7  115.2,33.5 0 top
X8  115.2,60.5 0 top
X9  70.7,5 180 top
X10  56.7,5 180 top
X11  63.7,5 180 top
X12  8.7,5 0 top
X13  22.7,5 0 top
X14  15.7,5 0 top
X15  32.7,5 0 top
X16  46.7,5 0 top
X17  39.7,5 0 top
X18  80.7,5 0 top
X19  112.2,5 0 top
X20  87.7,5 0 top

### Tracks (layer width: path | path; a pad name or v marks a point on that pad's centre or on a via)
3.3V  (2 unrouted)
5V  (2 unrouted)
GND  (via drill 0.8)  (7 unrouted)
  other vias: 83.4,49 94.1,8.3 67.4,8.4 43.3,8.7 18.7,8.6
  pour Top: -8.9,85.7 -8.9,-3.9 128.5,-3.9 128.5,85.7
  pour Bottom: -8.8,85.6 -8.8,-4 128.6,-4 128.6,85.6
GND1  (1 unrouted)
N$1  (1 unrouted)
N$2  (1 unrouted)
N$3  (1 unrouted)
N$4  (1 unrouted)
N$5  (1 unrouted)
N$6  (3 unrouted)
N$7  (1 unrouted)
N$8  (3 unrouted)
N$9  (1 unrouted)
N$10  (1 unrouted)
N$11  (1 unrouted)
N$12  (3 unrouted)
N$14  (3 unrouted)
N$16  (1 unrouted)
POE_A+  (3 unrouted)
POE_A-  (5 unrouted)
POE_B+  (7 unrouted)
POE_B-  (3 unrouted)
PTEST
  Top 0.813: X10.1 X11.1 X9.1
  Bottom 2.54: X9.1 X11.1 X10.1
PTEST1
  Top 0.813: X13.1 X14.1 X12.1
  Bottom 2.54: X12.1 X14.1 X13.1
PTEST2
  Top 0.813: X16.1 X17.1 X15.1
  Bottom 2.54: X15.1 X17.1 X16.1
PTEST3
  Top 0.813: X19.1 X20.1 X18.1
  Bottom 2.54: X18.1 X20.1 X19.1
RTN  (7 unrouted)